# EAGLE design zxclone (EAGLE 6.4)
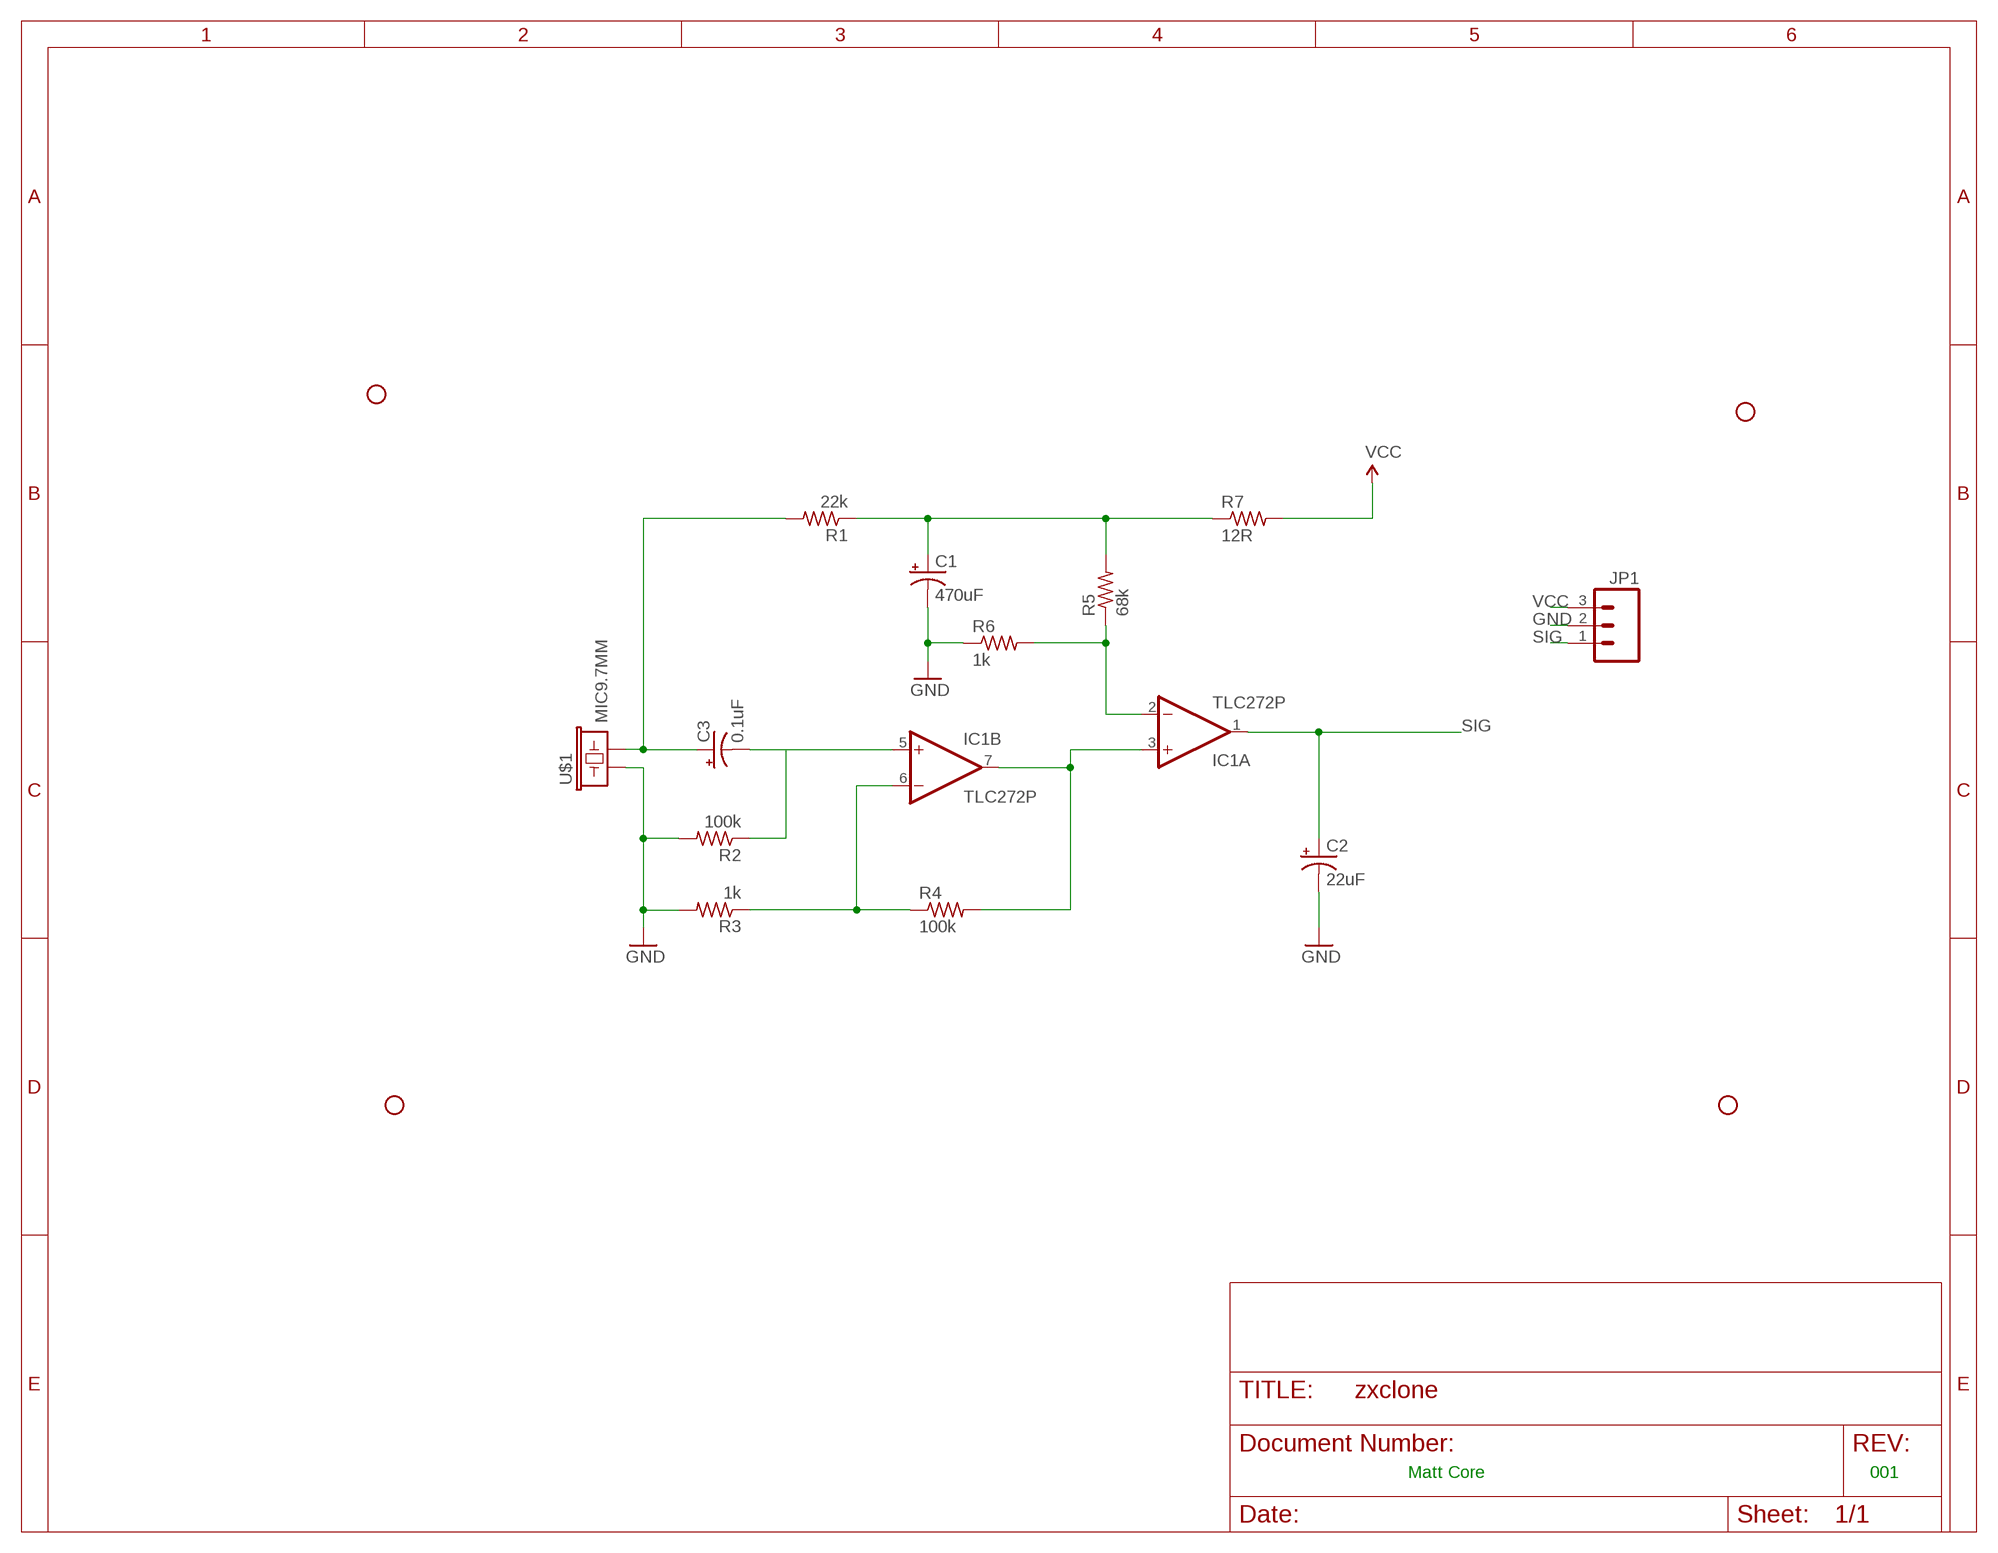
[diagram p0: schematic, sheet 1]

## Parts
C1  470uF  CPOL-USE2.5-7  [E2,5-7]
C2  22uF  CPOL-USE5-4  [E5-4]
C3  0.1uF  CPOL-USE1.8-4  [E1,8-4]
IC1  TLC272P  [DIL08]
JP1  M03PTH  [1X03]
R1  22k  R-US_0207/10  [0207/10]
R2  100k  R-US_0207/10  [0207/10]
R3  1k  R-US_0207/10  [0207/10]
R4  100k  R-US_0207/10  [0207/10]
R5  68k  R-US_0207/10  [0207/10]
R6  1k  R-US_0207/10  [0207/10]
R7  12R  R-US_0207/10  [0207/10]
STANDOFF1  STAND-OFF  [STAND-OFF]
STANDOFF2  STAND-OFF  [STAND-OFF]
STANDOFF3  STAND-OFF  [STAND-OFF]
STANDOFF4  STAND-OFF  [STAND-OFF]
U$1  MIC9.7MM  [MIC-9.7MM]

## Nets
GND: C1.- C2.- JP1.2 R2.2 R3.2 R6.1 U$1.1
N$1: C1.+ R1.1 R5.2 R7.1
N$2: IC1.2(A:-IN) R5.1 R6.2
N$3: IC1.3(A:+IN) IC1.7(B:OUT) R4.2
N$4: IC1.6(B:-IN) R3.1 R4.1
N$5: C3.- IC1.5(B:+IN) R2.1
N$7: C3.+ R1.2 U$1.2
SIG: C2.+ IC1.1(A:OUT) JP1.1
VCC: JP1.3 R7.2

## Notes on the sheet
- Matt Core | 001

## Power pins joined to a net without a drawn wire
V+: IC1.8(P:V+)
V-: IC1.4(P:V-)

## Library data of the parts
C1-C3 = resistor:CPOL-US: POLARIZED CAPACITOR, American symbol
IC1 = linear:TLC272: OP AMP
JP1 = SparkFun-Connectors:M03: Header 3 Standard 3-pin 0.1" header. Use with straight break away headers (SKU : PRT-00116), right angle break away headers (PRT-00553), swiss pins (PRT-00743), machine pins (PRT-00117), and female headers (PRT-00115). Molex polarized connector foot print use with SKU : PRT-08232 with associated crimp pins and housings.
R1-R7 = resistor:R-US_: RESISTOR, American symbol
STANDOFF1-STANDOFF4 = SparkFun-Electromechanical:STAND-OFF: #4 Stand Off This is the mechanical footprint for a #4 phillips button head screw. Use the keepout ring to avoid running the screw head into surrounding components. SKU : PRT-00447
U$1 = SparkFun-Sensors:MIC: Omni-directional electret microphone. 9.7mm standard diameter.

## Board
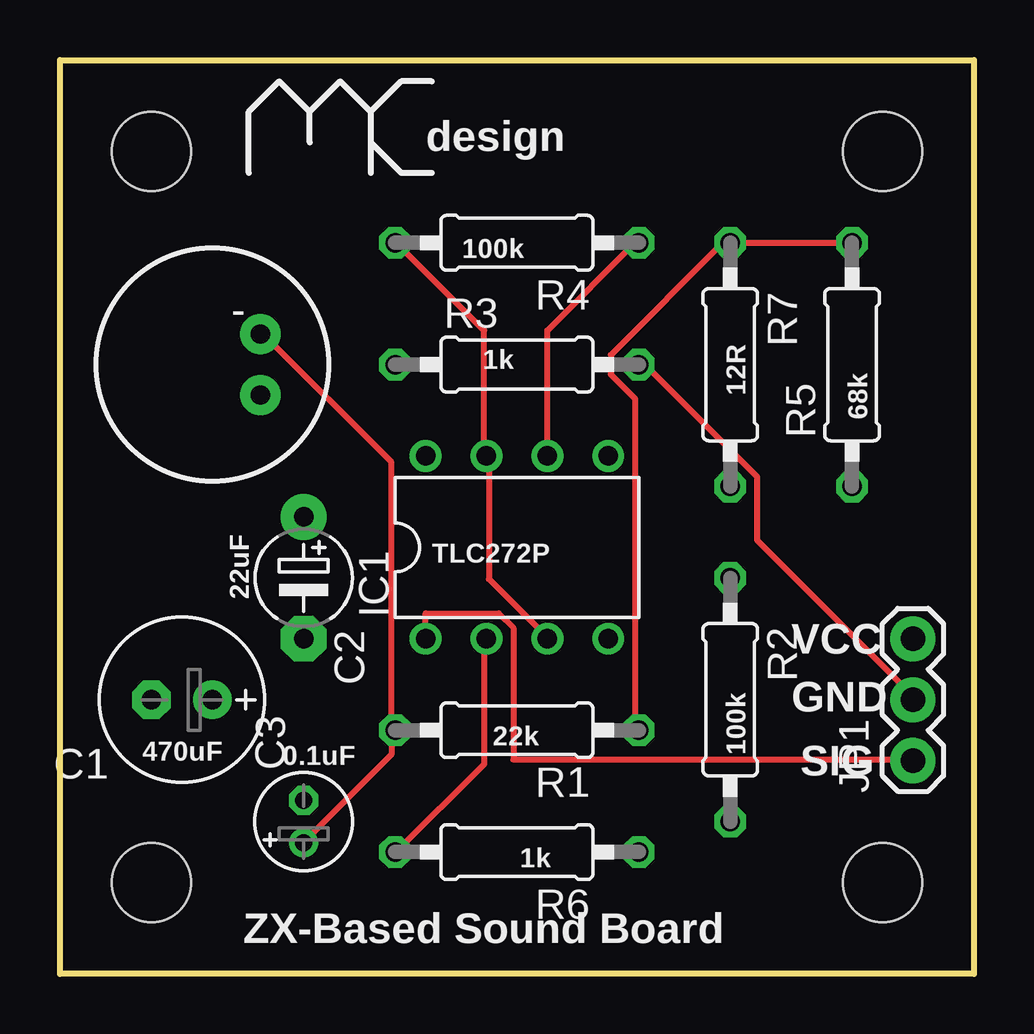
[diagram p1: board, top side]
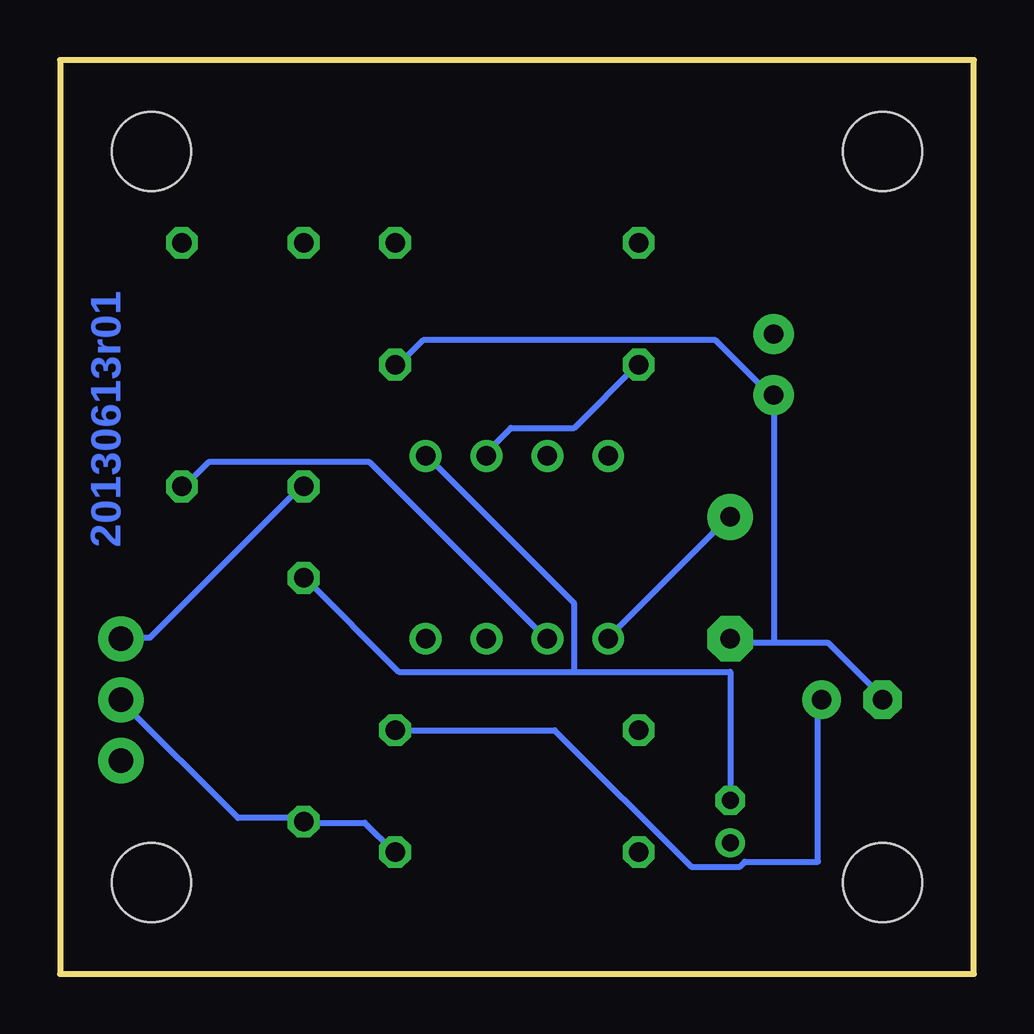
[diagram p2: board, bottom side, seen from below]

Size 38.1 x 38.1 mm. Coordinates in mm from the lower left corner, seen from the top.
Outline: 0,0 38.1,0 38.1,38.1 0,38.09 0,0
Copper layers (1*16): Top 0.035mm / dielectric 1.5mm / Bottom 0.035mm
Design rules "default": minimum track width 10mil, minimum drill 24mil, track to track 8mil, track to pad 8mil, pad to pad 8mil, via to via 8mil, smd to smd 8mil, copper to edge 40mil, drill to drill 8mil, minimum pad ring 10mil, minimum via ring 8mil, stop-mask expansion 4mil, vias tented up to drill 0mil, thermal gap 10mil
Milling: 4 lines

### Footprints (pad centres in the part's own frame; a part is rotated, then mirrored left to right if it is on the bottom)
E2,5-7 = drill 0.813 pad 1.6: + -1.27,0 | drill 0.813 pad 1.6 octagon: - 1.27,0
E5-4 = drill 0.813 pad 1.905: + -2.54,0 | drill 0.813 pad 1.905 octagon: - 2.54,0
E1,8-4 = drill 0.711 pad 1.168: + -0.889,0 | drill 0.711 pad 1.168 octagon: - 0.889,0
DIL08 = drill 0.813 pad 1.27: 1 -3.81,-3.81; 2 -1.27,-3.81; 3 1.27,-3.81; 4 3.81,-3.81; 5 3.81,3.81; 6 1.27,3.81; 7 -1.27,3.81; 8 -3.81,3.81
1X03 = drill 1.016 pad 1.88: 1 0,0; 2 2.54,0; 3 5.08,0
0207/10 = drill 0.813 octagon: 1 -5.08,0; 2 5.08,0
STAND-OFF = hole 3.302: 0,0
MIC-9.7MM = drill 0.8 pad 1.676: 1 -2,1.27; 2 -2,-1.27

### Placement (x,y rotation side)
C1  5.08,11.43 180 top
C2  10.16,16.51 270 top
C3  10.16,6.35 90 top
IC1  19.05,17.78 0 top
JP1  35.56,8.89 90 top
R1  19.05,10.16 180 top
R2  27.94,11.43 270 top
R3  19.05,25.4 0 top
R4  19.05,30.48 180 top
R5  33.02,25.4 90 top
R6  19.05,5.08 180 top
R7  27.94,25.4 270 top
STANDOFF1  3.81,34.29 0 top
STANDOFF2  34.29,34.29 0 top
STANDOFF3  3.81,3.81 0 top
STANDOFF4  34.29,3.81 0 top
U$1  6.35,25.4 180 top

### Tracks (layer width: path | path; a pad name or v marks a point on that pad's centre or on a via)
GND
  Top 0.254: R3.2 24.38,25.4 29.06,20.73 29.06,18.09 35.56,11.58 JP1.2
  Bottom 0.254: R6.1 24.18,5.08 25.4,6.3 27.84,6.3 R2.2 28.04,6.5 30.68,6.5 35.56,11.38 JP1.2 | 8.33,13.82 10.16,13.82 C2.- | 8.33,13.82 6.1,13.82 3.86,11.58 C1.- | R3.2 23.98,25.4 22.96,26.42 10.77,26.42 8.53,24.18 U$1.1 8.33,23.98 8.33,13.82
N$1
  Top 0.254: R1.1 23.98,10.16 23.98,23.98 22.96,24.99 22.96,25.81 27.64,30.48 R7.1 R5.2
  Bottom 0.254: R1.1 17.48,10.16 11.79,4.47 9.75,4.47 9.55,4.67 6.5,4.67 6.5,11.38 C1.+
N$2
  Top 0.254: R6.2 14.02,5.08 17.68,8.74 17.68,13.82 IC1.2
  Bottom 0.254: R5.1 32.92,20.32 31.9,21.34 25.2,21.34 17.88,14.02 IC1.2
N$3
  Top 0.254: IC1.3 20.32,14.02 17.88,16.46 17.88,21.54 IC1.7 17.68,21.74 17.68,26.82 14.02,30.48 R4.2
N$4
  Top 0.254: IC1.6 20.32,26.82 23.98,30.48 R4.1
  Bottom 0.254: R3.1 14.02,25.4 16.66,22.76 19.3,22.76 20.32,21.74 IC1.6
N$5
  Bottom 0.254: C3.- 10.16,12.6 16.66,12.6 | 16.66,12.6 23.98,12.6 27.84,16.46 R2.1 | 16.66,12.6 16.66,15.44 22.76,21.54 IC1.5
N$7
  Top 0.254: 13.82,10.16 13.82,9.14 10.16,5.49 C3.+ | 13.82,10.16 13.82,21.34 8.53,26.62 U$1.2 | 13.82,10.16 R1.2
SIG
  Top 0.254: IC1.1 15.24,15.04 18.29,15.04 18.9,14.43 18.9,8.94 35.56,8.94 JP1.1
  Bottom 0.254: IC1.1 15.24,14.02 10.36,18.9 10.16,18.9 C2.+
VCC
  Bottom 0.254: R7.2 28.04,20.32 34.34,14.02 35.56,14.02 JP1.3

### Text on the board
Bottom: 20130613r01
tPlace: design | 100k | 1k | 12R | 68k | TLC272P | 22uF | VCC | GND | 0.1uF | 22k | 470uF | 100k | SIG | 1k | ZX-Based Sound Board